# Altium schematic sheet SensingVlt.SchDoc
size A3; SPICEModelCachePBRVILHZ: <root> / <DocumentId>PBRVILHZ</DocumentId> / <CacheFrame Number="0"> / <Model Name="npn" Kind="MDL"> / <Text>*Default NPN BJT / *NPN Trans Pinout: C,B,E / .MODEL NPN NPN()</Text> / </Model> / </CacheFrame> / </root>
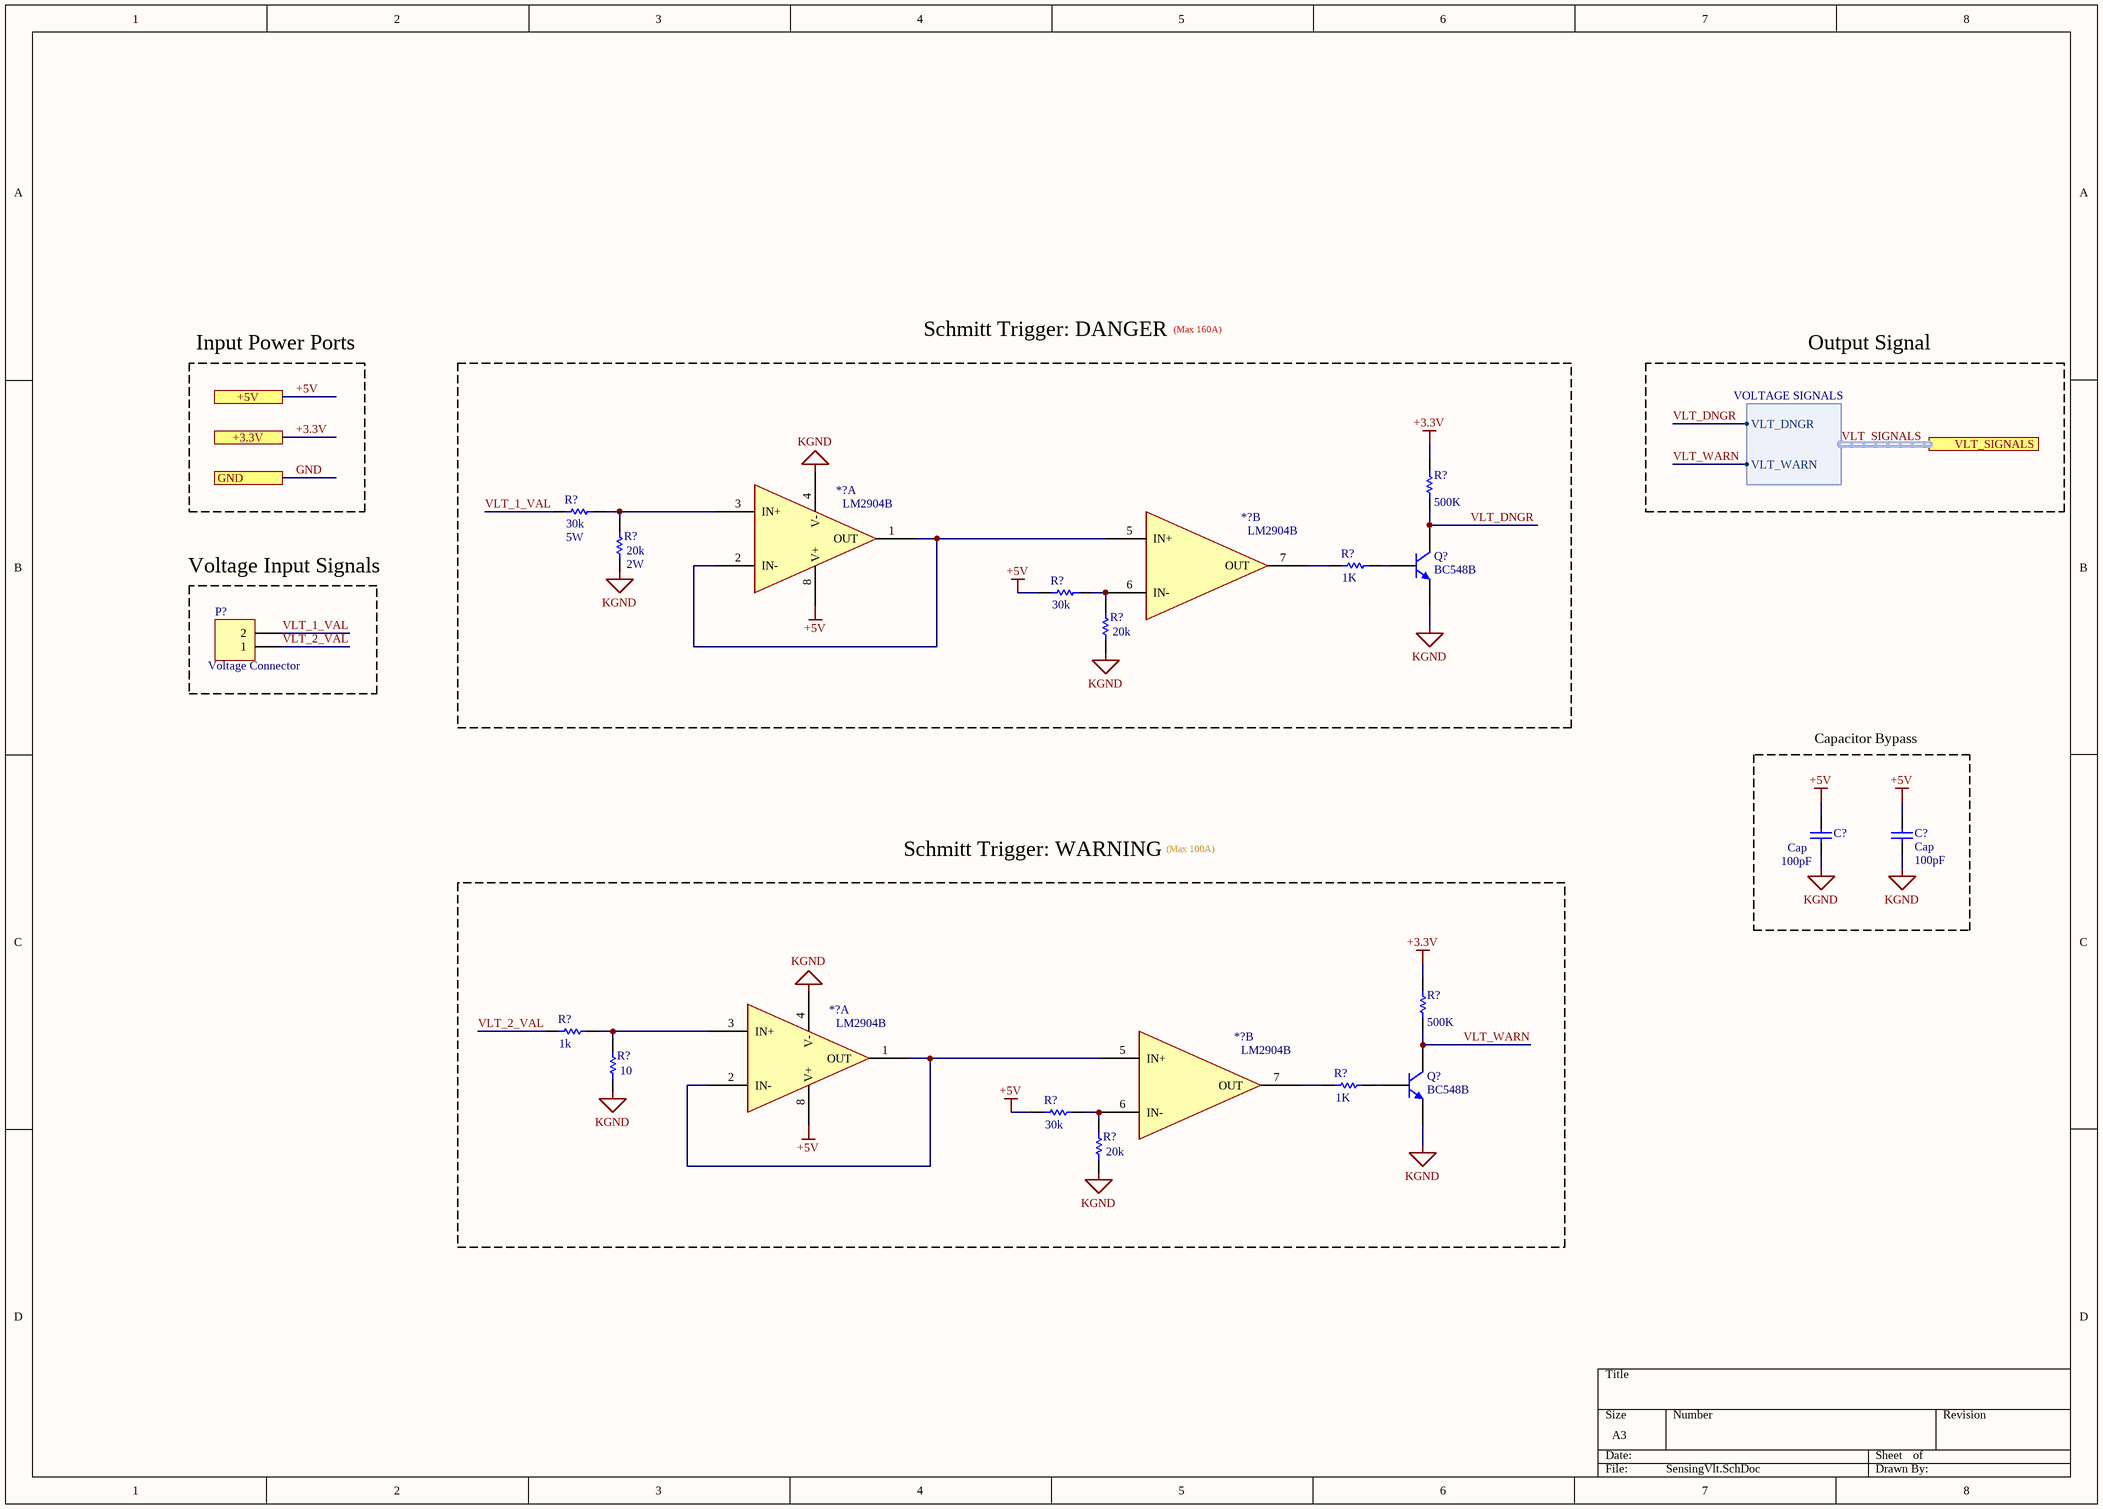
[diagram p0: SensingVlt.SchDoc]

## Parts
(Parts that share a designator on the sheet are numbered #1, #2 ... from top to bottom, then left to right.)
*?#1  LM2904B  (part A of 2)
*?#2  LM2904B  (part B of 2)
*?#3  LM2904B  (part A of 2)
*?#4  LM2904B  (part B of 2)
C?#1  Cap  value 100pF  [RAD-0.3]
C?#2  Cap  value 100pF  [RAD-0.3]
P?  Voltage Connector  [HDR1X2]
Q?#1  BC548B  [TO-226-AA]
Q?#2  BC548B  [TO-226-AA]
R?#1  5W  value 30k  [AXIAL-0.3]
R?#2  value 500K  [AXIAL-0.3]  (hidden comment: Res1)
R?#3  value 1K  [AXIAL-0.3]  (hidden comment: Res1)
R?#4  2W  value 20k  [AXIAL-0.3]
R?#5  value 30k  [AXIAL-0.3]  (hidden comment: Res1)
R?#6  value 20k  [AXIAL-0.3]  (hidden comment: Res1)
R?#7  value 1k  [AXIAL-0.3]  (hidden comment: Res1)
R?#8  value 500K  [AXIAL-0.3]  (hidden comment: Res1)
R?#9  value 1K  [AXIAL-0.3]  (hidden comment: Res1)
R?#10  value 10  [AXIAL-0.3]  (hidden comment: Res1)
R?#11  value 30k  [AXIAL-0.3]  (hidden comment: Res1)
R?#12  value 20k  [AXIAL-0.3]  (hidden comment: Res1)

## Blocks framed on the sheet
Voltage Input Signals: P?
Capacitor Bypass: C?#1 C?#2

## Ports
+3.3V, +5V, GND, VLT_SIGNALS (harness VOLTAGE SIGNALS)

## Harnesses
VOLTAGE SIGNALS: VLT_DNGR, VLT_WARN

## Nets
+3.3V: R?#2.2 R?#8.2 ; port +3.3V
+5V: *?#1.8(V+) *?#3.8(V+) C?#1.1 C?#2.1 R?#5.1 R?#11.1 ; port +5V
KGND: *?#1.4(V-) *?#3.4(V-) C?#1.2 C?#2.2 Q?#1.3(E) Q?#2.3(E) R?#4.1 R?#6.1 R?#10.1 R?#12.1
GND: port GND
VLT_1_VAL: P?.2 R?#1.1
VLT_2_VAL: P?.1 R?#7.1
VLT_DNGR: Q?#1.1(C) R?#2.1 ; port VLT_SIGNALS.VLT_DNGR
VLT_WARN: Q?#2.1(C) R?#8.1 ; port VLT_SIGNALS.VLT_WARN  [project net VLT_SIGNALS.VLT_WARN]
Net*?#1_1: *?#1.1(OUT) *?#1.2(IN-) *?#2.5(IN+)
Net*?#1_3: *?#1.3(IN+) R?#1.2 R?#4.2
Net*?#2_6: *?#2.6(IN-) R?#5.2 R?#6.2
Net*?#2_7: *?#2.7(OUT) R?#3.1
Net*?#3_1: *?#3.1(OUT) *?#3.2(IN-) *?#4.5(IN+)
Net*?#3_3: *?#3.3(IN+) R?#7.2 R?#10.2
Net*?#4_6: *?#4.6(IN-) R?#11.2 R?#12.2
Net*?#4_7: *?#4.7(OUT) R?#9.1
NetQ?#1_2: Q?#1.2(B) R?#3.2
NetQ?#2_2: Q?#2.2(B) R?#9.2

## Buses and harness runs
harness VLT_SIGNALS = port VLT_SIGNALS

## Notes on the sheet
- Input Power Ports
- Schmitt Trigger: DANGER
- (Max 160A)
- Output Signal
- Schmitt Trigger: WARNING
- (Max 100A)

## Library data of the parts
C?#1 C?#2 = Cap: Capacitor; Published: 8-Jun-2000; LatestRevisionDate: 17-Jul-2002; LatestRevisionNote: Re-released for DXP Platform.; PackageReference: RAD-0.3; Publisher: Altium Limited; PackageDescription: Radial Cap, Thru-Hole; 2 Leads; 0.3 in Pin Spacing
P? = CMP-002-00141-1: Header, 2-Pin; Component Type: Standard; Source: Miscellaneous Connectors.SchLib; LatestRevisionDate: 17-Jul-2002; LatestRevisionNote: Re-released for DXP Platform.; Signal Integrity: Connector; Publisher: Altium Limited; Pins: 2; Design Item ID: Header 2
Q?#1 Q?#2 = NPN: NPN Bipolar Transistor; Published: 8-Jun-2000; LatestRevisionDate: 17-Jul-2002; LatestRevisionNote: Re-released for DXP Platform.; PackageReference: TO-226-AA; Publisher: Altium Limited; PackageDescription: TO, Flat Index; 3 In-Line, Axial Leads; Body Dia. 4.8mm; Leads 0.55 x 0.51 mm (max); Code_JEDEC: TO-226-AA
R?#1-R?#12 = Res1: Resistor; Published: 8-Jun-2000; LatestRevisionDate: 17-Jul-2002; LatestRevisionNote: Re-released for DXP Platform.; PackageReference: AXIAL-0.3; Publisher: Altium Limited; PackageDescription: Axial Device, Thru-Hole; 2 Leads; 0.3 in Pin Spacing